# EasyEDA Pro project ProProject_XIAO_NRF52833_2024-01-15.epro, schematic Schematic4
Create Date: 2023-09-27; Page Name: P1; Project Name: XIAO_NRF52833; Schematic Name: Schematic4; Update Date: 2023-09-27; Company: EasyEDA.com; Drawed: EasyEDA Pro; Page Size: A4; Part Number: JLCPCB-002; Reviewed: EasyEDA Pro; Version: V0.1
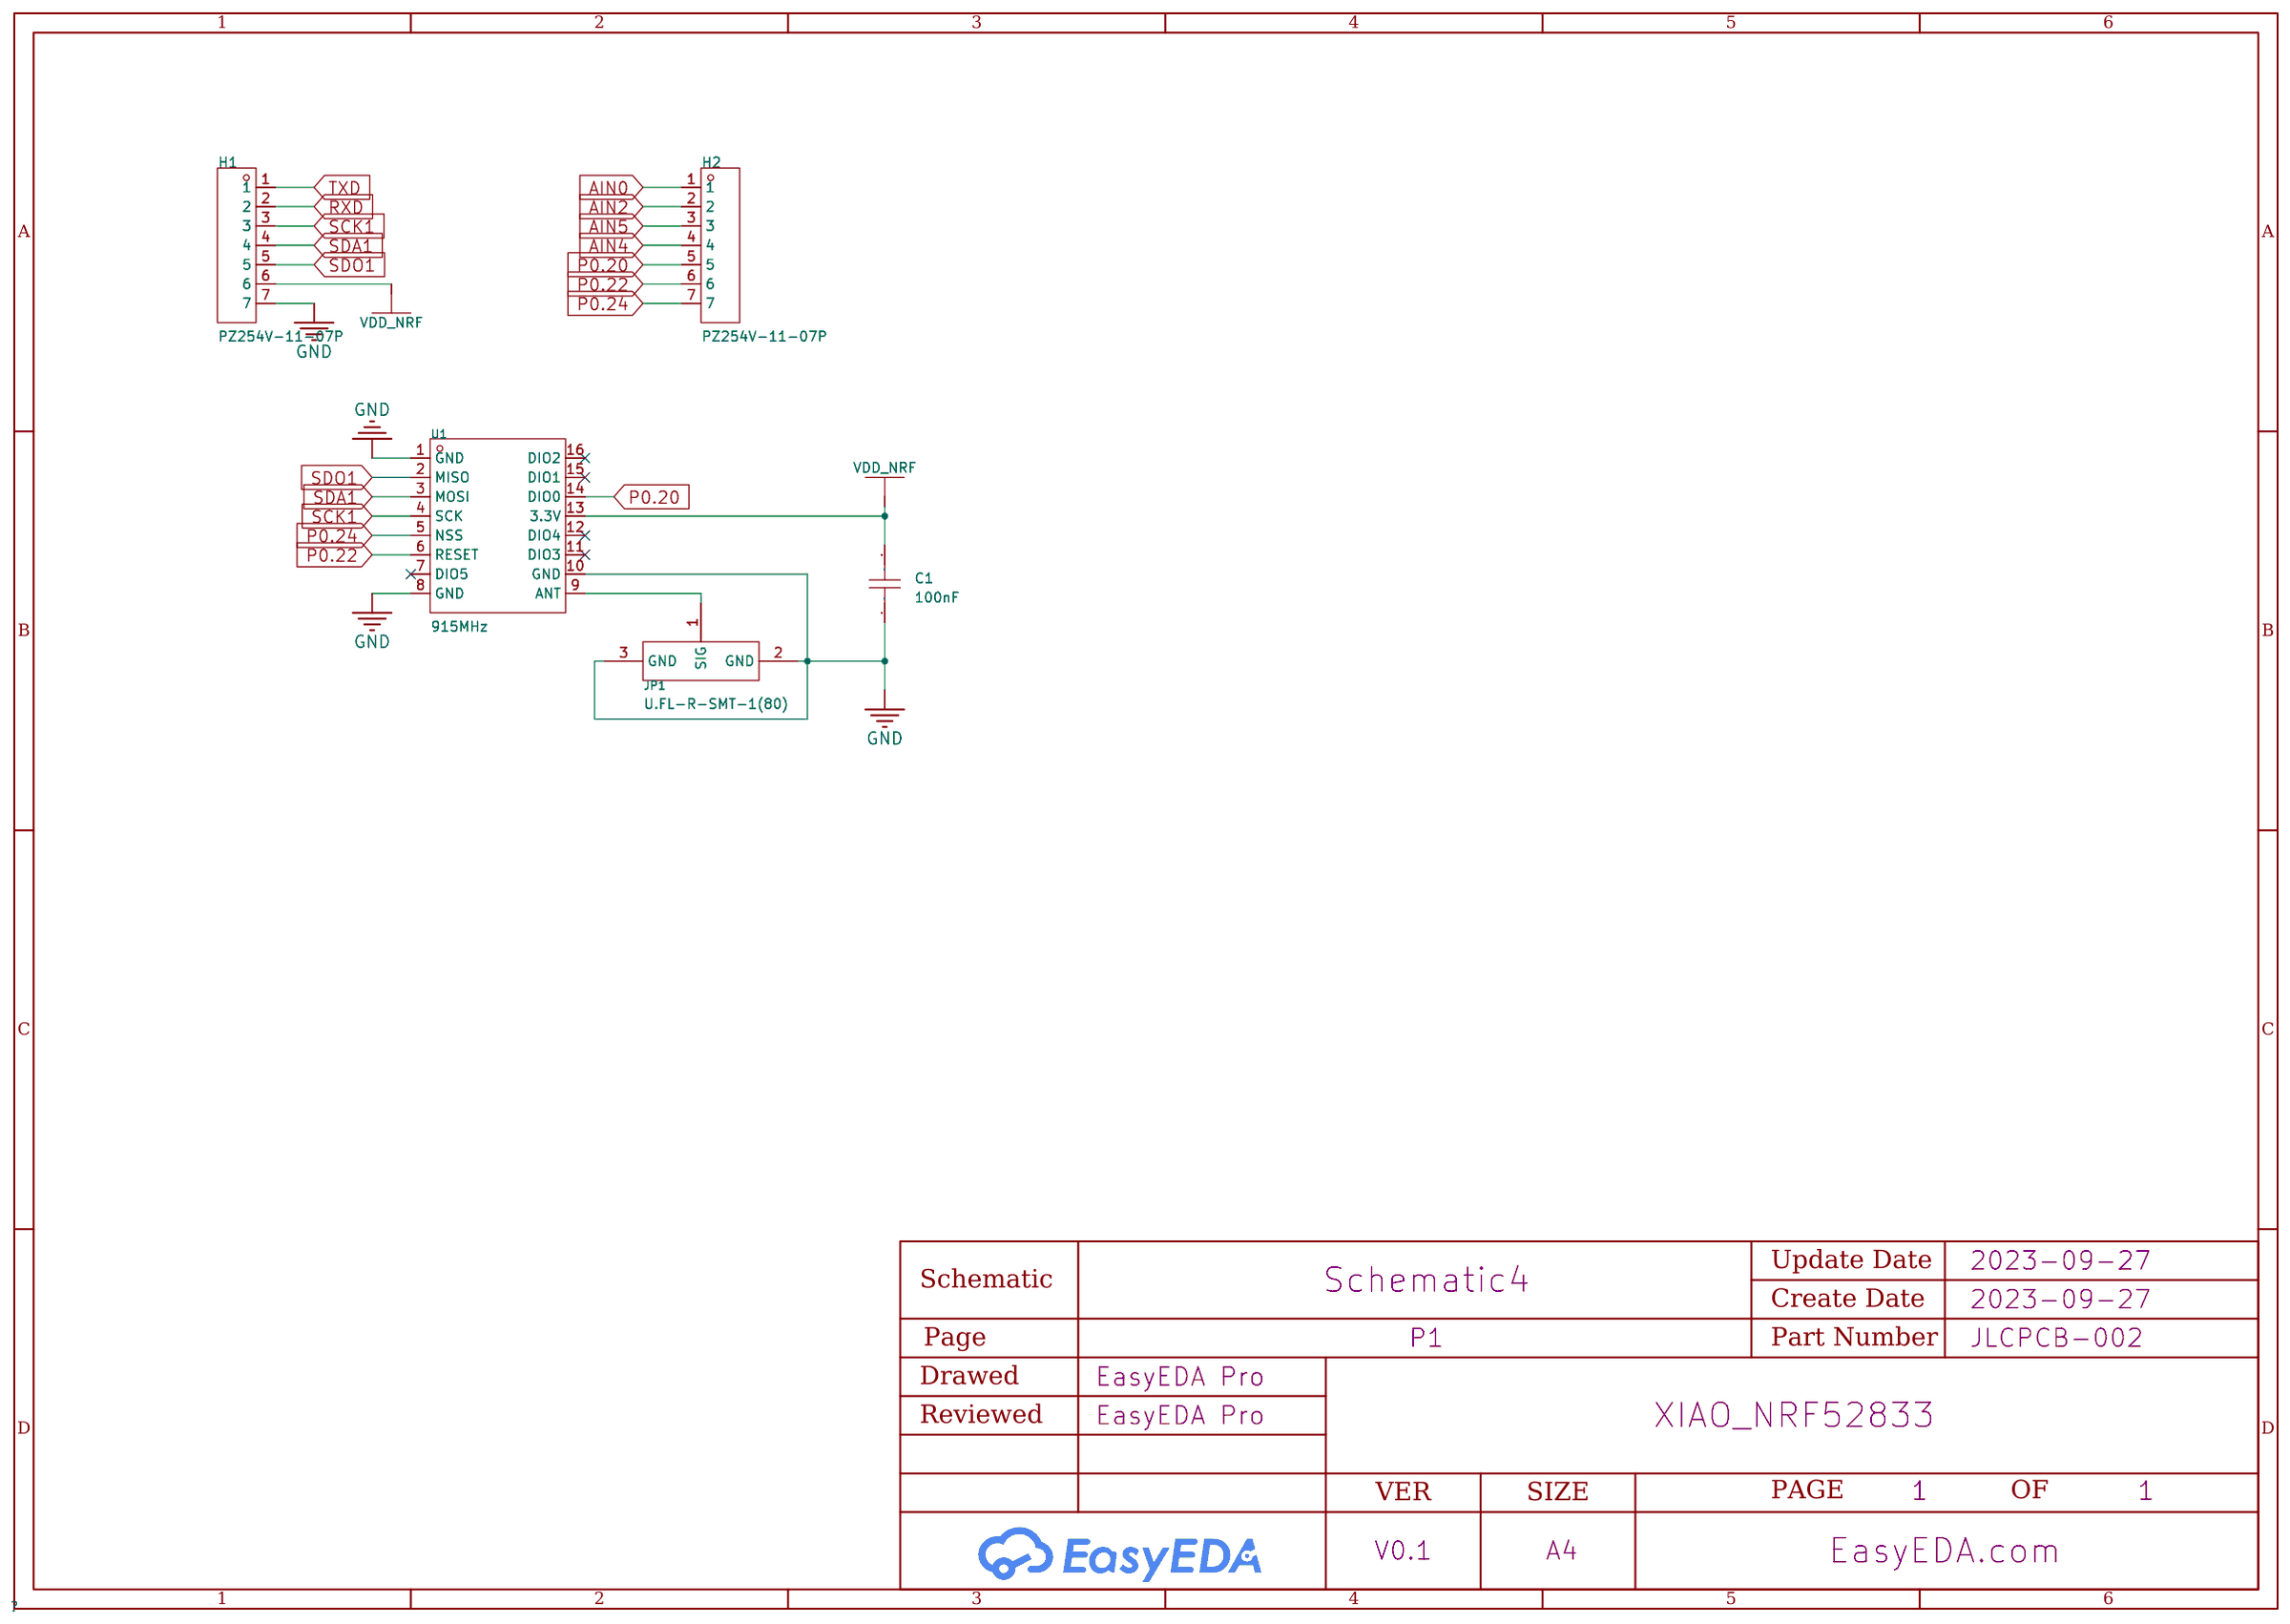
[diagram p2: schematic sheet]

## Parts
C1  100nF  [C0201]
H1  PZ254V-11-07P  [HDR-TH_7P-P2.54-V-M]  (no BOM)
H2  PZ254V-11-07P  [HDR-TH_7P-P2.54-V-M]  (no BOM)
JP1  U.FL-R-SMT-1(80)  [RF-SMD_FRF05002-JSS103M]
U1  915MHz  [LCC-16_L16.0-W16.0-P2.00-TL]

## Library data of the parts
C1 = CL03A104KQ3NNNC: Capacitance: Tolerance:±10% Tolerance:±10% Voltage Rated: Temperature Coefficient:; LCSC Part Name: 100nF ±10% 6.3V; Supplier Part: C160831; Manufacturer: SAMSUNG(三星); Supplier Footprint: 0201; JLCPCB Part Class: Extended Part; Datasheet: https://atta.szlcsc.com/upload/public/pdf/source/20171228/C160831_15144412250661213800.pdf; Supplier: LCSC; Tolerance: ±10%
H1 H2 = PZ254V-11-07P: Number of Rows:Plugin Number of Pins:7P Pitch:2.54mm Pin Structure:1x7P Row Spacing:- Mounting Type:Straight Circluar Pins/Square Pins:Square Pins Current Rating (Max):- Voltage Rating (Max):- Length of Mating Pin:6mm Insulation Height:2.5mm Length of End; LCSC Part Name: 2.54mm 1x7P 直插 方针; Supplier Part: C492406; Manufacturer: XFCN(兴飞); Supplier Footprint: 插件,P=2.54mm; JLCPCB Part Class: Extended Part; Datasheet: https://atta.szlcsc.com/upload/public/pdf/source/20200309/C492406_654C533EE691117E22DD9F76C114C2D9.pdf; Supplier: LCSC; Number of Rows: Plugin; Number of Pins: 7P; Pitch: 2.54mm; Pin Structure: 1x7P; Mounting Type: Straight; Circluar Pins/Square Pins: Square Pins; Length of Mating Pin: 6mm; Insulation Height: 2.5mm; Length of End Connection Pin: 3mm; Operating Temperature Range: -40℃~+105℃; Color: Black
JP1 = U.FL-R-SMT-1(80)_C88374: LCSC Part Name: 3310472280，IPE-X板端 IPX接头，贴片; Supplier Part: C88374; Manufacturer: HRS(广濑); Supplier Footprint: SMD; JLCPCB Part Class: Extended Part; Supplier: LCSC
U1 = DL-RFM95-915M: Frequency:915MHz Output Power:-1dBm~95dBm Output Power:-1dBm~95dBm Support Interface:SPI Antenna Type:- Modulation System:LoRa；MSK；GFSK；FSK；GMSK Operating Voltage:3.3V Operating Voltage:3.3V Receive  Current:10.8mA Send  Current:120mA Sensitivity:-111dBm~; LCSC Part Name: 915MHz无线模块sx1276; Supplier Part: C2844473; Manufacturer: DreamLNK(骏晔科技); Supplier Footprint: SMD,16x16mm; JLCPCB Part Class: Extended Part; Datasheet: https://atta.szlcsc.com/upload/public/pdf/source/20210707/C2844473_397B2B14A10B449F98C8D505C954CDE6.pdf; Supplier: LCSC; Output Power: -1dBm~95dBm; Support Interface: SPI; Modulation System: LoRa；MSK；GFSK；FSK；GMSK; Operating Voltage: 3.3V; Receive  Current: 10.8mA; Send  Current: 120mA; Sensitivity: -111dBm~-148dBm; Operating Temperature: -20℃~+70℃

## Nets
GND: C1.1 H1.7 JP1.2(GND) JP1.3(GND) U1.1(GND) U1.8(GND) U1.10(GND)
VDD_NRF: C1.2 H1.6 U1.13(3.3V)
AIN0: H2.1
AIN2: H2.2
AIN4: H2.4
AIN5: H2.3
P0.20: H2.5 U1.14(DIO0)
P0.22: H2.6 U1.6(RESET)
P0.24: H2.7 U1.5(NSS)
RXD: H1.2
SCK1: H1.3 U1.4(SCK)
SDA1: H1.4 U1.3(MOSI)
SDO1: H1.5 U1.2(MISO)
TXD: H1.1
$1N722: JP1.1(SIG) U1.9(ANT)

Not connected (* = marked no-connect by the designer): U1 7(DIO5)* 11(DIO3)* 12(DIO4)* 15(DIO1)* 16(DIO2)*
